# Altium schematic sheet AMU-S06-V00-CANACC.SchDoc: Isolated CANBUS4 3V3
size A3; DrawnBy: Jonn Dillon; DocumentNumber: 6; Revision: 01; SheetNumber: 6; SheetTotal: 25; Version: 01; Project: AMU 2020 (Sourced from BMS 2020); PageSetup: Record=PageOptions|CenterHorizontal=True|CenterVertical=True|PrintScale=0.97|XCorrection=1.00|YCorrection=1.00|PrintKind=0|BorderSize=5000000|LeftOffset=0|BottomOffset=0|Orientation=2|PaperLength=1000|PaperWidth=1000|Scale=100|PaperSource=7|PrintQuality=-4|MediaType=1|DitherType=10|PaperKind=A4|PrintScaleMode=1
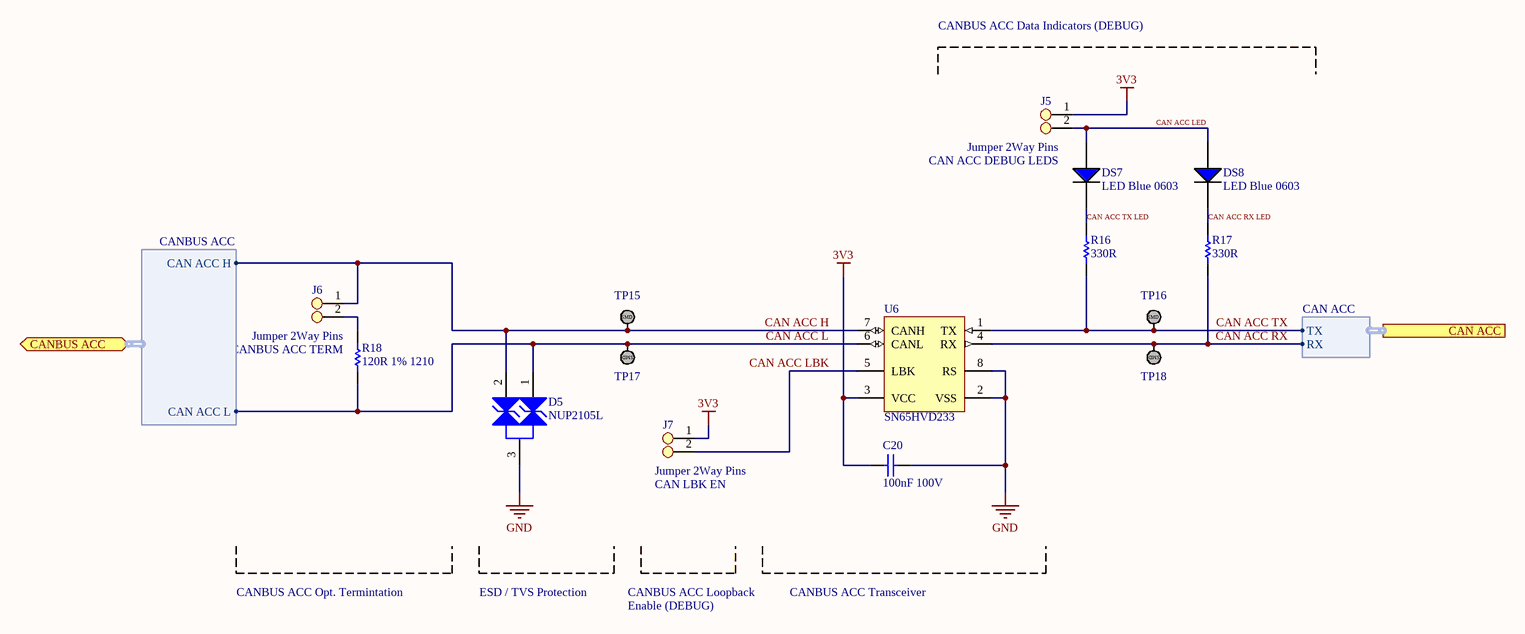
[diagram p0: AMU-S06-V00-CANACC.SchDoc]

## Parts
C20  100nF 100V  [Cap_Ceramic_0603]
D5  NUP2105L  [NUP2105L]
DS7  LED Blue 0603  [LED BLUE 0603]
DS8  LED Blue 0603  [LED BLUE 0603]
J5  Jumper 2Way Pins  [Jumper_2Way_Pin]
J6  Jumper 2Way Pins  [Jumper_2Way_Pin]
J7  Jumper 2Way Pins  [Jumper_2Way_Pin]
R16  330R  [Res_ThinFilm_0603]
R17  330R  [Res_ThinFilm_0603]
R18  120R 1% 1210  [Res_ThinFilm_1210]
TP15  TestPoint_SMD  [TestPointSMD]  (value not drawn)
TP16  TestPoint_SMD  [TestPointSMD]  (value not drawn)
TP17  TestPoint_SMD  [TestPointSMD]  (value not drawn)
TP18  TestPoint_SMD  [TestPointSMD]  (value not drawn)
U6  SN65HVD233  [SN65HVD233DR]

## Ports
CAN ACC (harness CAN ACC), CANBUS ACC (bidir, harness CANBUS ACC)

## Harnesses
CANBUS ACC: CAN ACC H, CAN ACC L
CAN ACC: RX, TX

## Nets
3V3: C20.2 J5.1 J7.1 U6.3(VCC)
GND: C20.1 D5.3 U6.2(VSS) U6.8(RS)
CAN ACC H: D5.2 J6.1 TP15.1 U6.7(CANH) ; port CANBUS ACC.CAN ACC H
CAN ACC L: D5.1 R18.1 TP17.1 U6.6(CANL) ; port CANBUS ACC.CAN ACC L
CAN ACC LBK: J7.2 U6.5(LBK)
CAN ACC LED: DS7.1(A) DS8.1(A) J5.2
CAN ACC RX: R17.1 TP18.1 U6.4(RX) ; port CAN ACC.RX
CAN ACC RX LED: DS8.2(C) R17.2
CAN ACC TX: R16.1 TP16.1 U6.1(TX) ; port CAN ACC.TX
CAN ACC TX LED: DS7.2(C) R16.2
NetJ6_2: J6.2 R18.2

## Notes on the sheet
- CANBUS ACC Data Indicators (DEBUG)
- CAN ACC DEBUG LEDS
- (near R18) CANBUS ACC TERM
- (near J7) CAN LBK EN
- CANBUS ACC Opt. Termintation
- ESD / TVS Protection
- CANBUS ACC Loopback
- Enable (DEBUG)
- CANBUS ACC Transceiver
- Revision History:
- Sheet Title:
- Rev
- Date
- Description
- Project:
- Size:
- Drawn By:
- A3
- Number:
- Revision:
- Sheet
- Version:
- of
- QUT Motorsport
- O-120, Gardens Point
- 2 George Street
- Brisbane, QLD 4000
- Australia
- Print Date:
- Print Time:
- File Name:
- (in symbol TestPoint_SMD) SMD

## Library data of the parts
C20 = 100nF 100V 5% X7R 0603: Capacitor, Ceramic, SMD, 100nF, 100V, 5%, X7R, 0603
J5-J7 = Jumper 2Way Side Pins
R16 R17 = 330R 5% 0603: Resistor, SMD, 330R, 0.1W, 5%, 0603
R18 = 120R 1% 1210: Resistor, SMD, 120R, 0.25W, 1%, 1210
D5 = NUP2105L: ComponentLink1Description: Datasheet; ComponentLink1URL: https://www.onsemi.cn/PowerSolutions/document/NUP2105L-D.PDF; Parameter 1: *; ComponentLink2Description: LCSC; ComponentLink2URL: https://lcsc.com/product-detail/TVS_ON-Semiconductor-NUP2105LT1G_C14486.html; ComponentLink3Description: Digikey; ComponentLink3URL: https://www.digikey.com.au/product-detail/en/on-semiconductor/SZNUP2105LT1G/SZNUP2105LT1GOSCT-ND/3487669
U6 = SN65HVD233: ComponentLink1Description: LCSC; ComponentLink1URL: https://lcsc.com/product-detail/CAN-ICs_Texas-Instruments_SN65HVD233DRG4_Texas-Instruments-Texas-Instruments-SN65HVD233DRG4_C61643.html; ComponentLink2Description: Digikey; ComponentLink2URL: https://www.digikey.com.au/product-detail/en/texas-instruments/SN65HVD233DR/296-35967-1-ND/4134960; ComponentLink3Description: Datasheet; ComponentLink3URL: https://www.ti.com/lit/ds/symlink/sn65hvd233.pdf?ts=1588560888178; ComponentLink4Description: Ti Product Page; ComponentLink4URL: https://www.ti.com/product/SN65HVD233